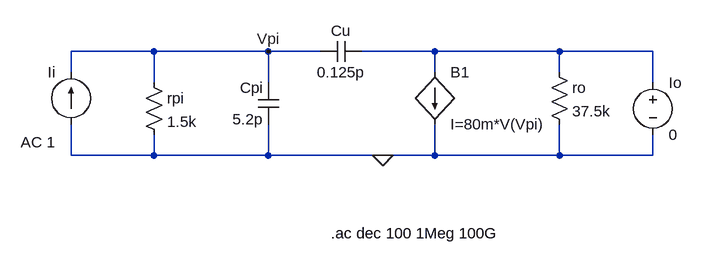
[diagram p0: schematic BJT.asc]
BJT.asc, the LTspice schematic file:
Version 4.1
SHEET 1 880 680
WIRE -96 128 -224 128
WIRE 80 128 -96 128
WIRE 160 128 80 128
WIRE 336 128 224 128
WIRE 528 128 336 128
WIRE 672 128 528 128
WIRE -224 160 -224 128
WIRE 336 160 336 128
WIRE 528 160 528 128
WIRE -96 176 -96 128
WIRE 80 176 80 128
WIRE 672 176 672 128
WIRE -224 288 -224 240
WIRE -96 288 -96 256
WIRE -96 288 -224 288
WIRE 80 288 80 240
WIRE 80 288 -96 288
WIRE 256 288 80 288
WIRE 336 288 336 240
WIRE 336 288 256 288
WIRE 528 288 528 240
WIRE 528 288 336 288
WIRE 672 288 672 256
WIRE 672 288 528 288
FLAG 256 288 0
FLAG 80 128 Vpi
SYMBOL cap 224 112 R90
WINDOW 0 0 32 VBottom 2
WINDOW 3 32 32 VTop 2
SYMATTR InstName Cu
SYMATTR Value 0.125p
SYMBOL cap 96 240 R180
WINDOW 0 24 56 Left 2
WINDOW 3 24 8 Left 2
SYMATTR InstName Cpi
SYMATTR Value 5.2p
SYMBOL res 512 144 R0
SYMATTR InstName ro
SYMATTR Value 37.5k
SYMBOL bi 336 160 R0
SYMATTR InstName B1
SYMATTR Value I=80m*V(Vpi)
SYMBOL voltage 672 160 R0
SYMATTR InstName Io
SYMATTR Value 0
SYMBOL res -112 160 R0
SYMATTR InstName rpi
SYMATTR Value 1.5k
SYMBOL current -224 240 R180
WINDOW 0 24 80 Left 2
WINDOW 3 24 0 Left 2
WINDOW 123 24 -28 Left 2
WINDOW 39 0 0 Left 0
SYMATTR InstName Ii
SYMATTR Value ""
SYMATTR Value2 AC 1
TEXT 176 408 Left 2 !.ac dec 100 1Meg 100G

The netlist it stands for:
* BJT.asc
Cu N001 Vpi 0.125p
Cpi 0 Vpi 5.2p
ro N001 0 37.5k
B1 N001 0 I=80m*V(Vpi)
V§Io N001 0 0
rpi Vpi 0 1.5k
Ii 0 Vpi AC 1
.ac dec 100 1Meg 100G
.backanno
.end